# Altium project Design 1 - Receiver Module.PrjPcb
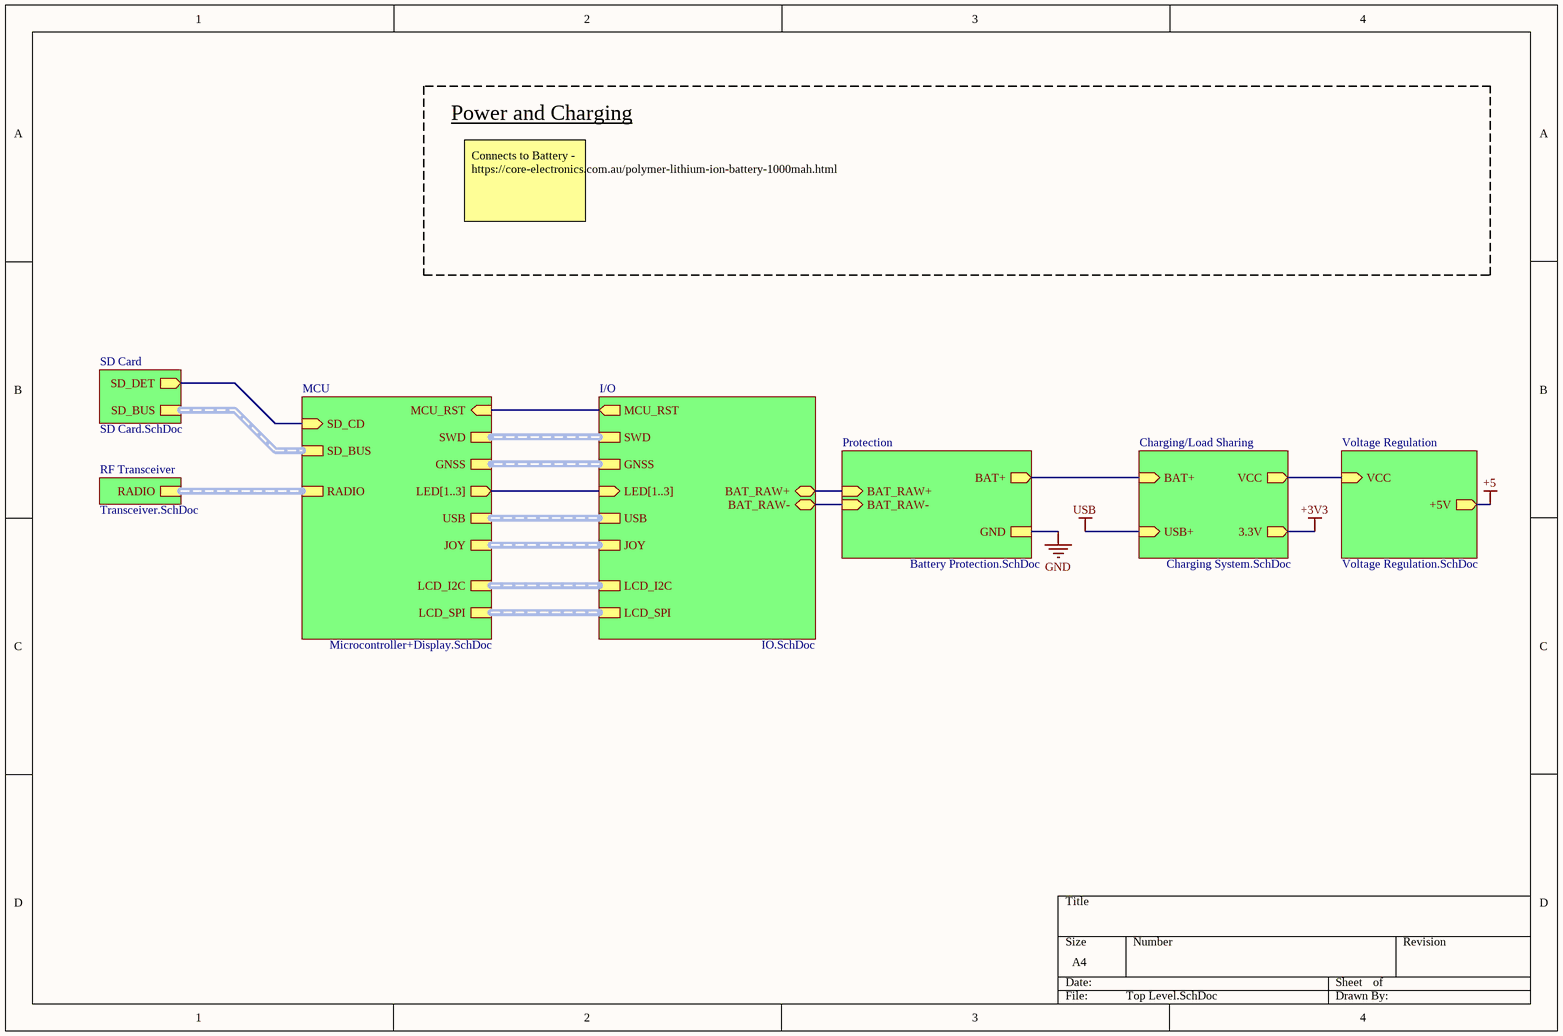
[diagram p0: Top Level.SchDoc]
7 sheets, 60 parts. Net scope: hierarchical (ports join the sheet entries above them; power ports are global).
Board file: Receiver Module.PcbDoc
Sheets:
  Top Level.SchDoc
    Voltage Regulation = Voltage Regulation.SchDoc
    I/O = IO.SchDoc
    RF Transceiver = Transceiver.SchDoc
    Protection = Battery Protection.SchDoc
    Charging/Load Sharing = Charging System.SchDoc
    SD Card = SD Card.SchDoc

## Sheet Top Level.SchDoc
size A4; SheetNumber: 1; SheetTotal: 8

### Sub-sheets
Charging/Load Sharing = Charging System.SchDoc: USB+ (in), BAT+ (in), VCC (out), 3.3V (out)
I/O = IO.SchDoc: USB (harness USB), SWD (harness SWD), JOY (harness JOY), LED[1..3] (in), MCU_RST (out), LCD_SPI (harness LCD_SPI), LCD_I2C (harness LCD_I2C), GNSS (harness GNSS), BAT_RAW+ (bidir), BAT_RAW- (bidir)
MCU = Microcontroller+Display.SchDoc (file not in this document): SD_BUS (harness SD_BUS), MCU_RST (in), SWD (harness SWD), RADIO (harness RADIO), USB (harness USB), JOY (harness JOY), SD_CD (in), LCD_I2C (harness LCD_I2C), LCD_SPI (harness LCD_SPI), LED[1..3] (out), GNSS (harness GNSS)
Protection = Battery Protection.SchDoc: BAT_RAW+ (in), BAT_RAW- (in), BAT+ (out), GND
RF Transceiver = Transceiver.SchDoc: RADIO (harness RADIO)
SD Card = SD Card.SchDoc: SD_BUS (harness SD_BUS), SD_DET (out)
Voltage Regulation = Voltage Regulation.SchDoc: VCC (in), +5V (out)

### Nets
BAT+: sheet I/O/BAT_RAW+, sheet Protection/BAT_RAW+, sheet Protection/BAT+, sheet Charging/Load Sharing/BAT+
BAT_RAW-: sheet I/O/BAT_RAW-, sheet Protection/BAT_RAW-
MCU_RST: sheet I/O/MCU_RST, sheet MCU/MCU_RST
NetC6_1: sheet Voltage Regulation/VCC, sheet Charging/Load Sharing/VCC
NetR1_2: sheet MCU/SD_CD, sheet SD Card/SD_DET

### Buses and harness runs
bus sheet I/O/LED[1..3] = sheet MCU/LED[1..3]
harness sheet I/O/GNSS = sheet MCU/GNSS
harness sheet I/O/JOY = sheet MCU/JOY
harness sheet I/O/LCD_I2C = sheet MCU/LCD_I2C
harness sheet I/O/LCD_SPI = sheet MCU/LCD_SPI
harness sheet I/O/SWD = sheet MCU/SWD
harness sheet I/O/USB = sheet MCU/USB
harness sheet MCU/RADIO = sheet RF Transceiver/RADIO
harness sheet MCU/SD_BUS = sheet SD Card/SD_BUS

### Notes on the sheet
- Power and Charging
- Connects to Battery - https://core-electronics.com.au/polymer-lithium-ion-battery-1000mah.html

## Sheet Voltage Regulation.SchDoc
size A4; SheetNumber: 4; SheetTotal: 8
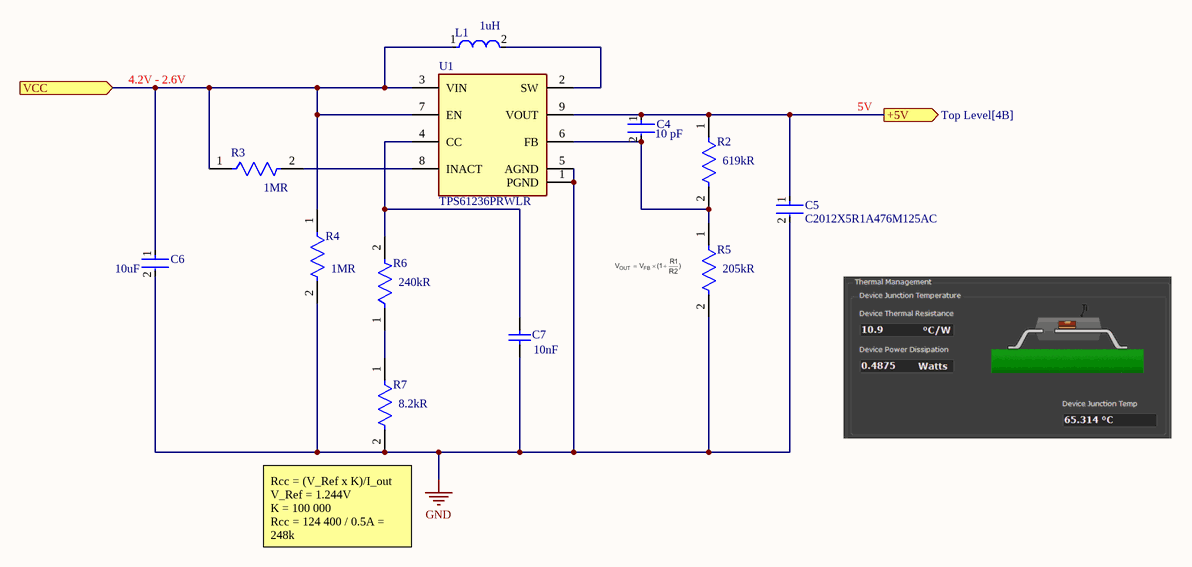
[diagram p1: Voltage Regulation.SchDoc]

### Parts
C4  value 10 pF  [FP-C0805C-DN-MFG]  (hidden comment: C0805C100M4GACTU)
C5  C2012X5R1A476M125AC  [FP-C2012-125-0_2-IPC_B]
C6  Capacitance: 10uF  [FP-GRM21B-0_15-IPC_A]  (hidden comment: GRM21BR61E106MA73L)
C7  Capacitance: 10nF  [CAPC1005X55X25NL05T10]  (hidden comment: GRM155R61A103KA01D)
L1  Inductance: 1uH  [FP-DFE201612C-MFG]  (hidden comment: 1286AS-H-1R0M=P2)
R2  Resistance: 619kR  [FP-CRCW0402-e3-IPC_C]  (hidden comment: CRCW0402619KFKED)
R3  Resistance: 1MR  [FP-CRCW0402-C-e3-MFG]  (hidden comment: CRCW04021M00FKEDC)
R4  Resistance: 1MR  [FP-CRCW0402-C-e3-MFG]  (hidden comment: CRCW04021M00FKEDC)
R5  Resistance: 205kR  [FP-AC0402-MFG]  (hidden comment: AC0402FR-07205KL)
R6  Resistance: 240kR  [FP-ESR03-MFG]  (hidden comment: ESR03EZPJ244)
R7  Resistance: 8.2kR  [FP-CRCW2010-e3-IPC_C]  (hidden comment: CRCW20108K20JNEF)
U1  TPS61236PRWLR  [TPS61235PRWLT]

### Ports
+5V (out, see Top Level[4B]), VCC (in, see Top Level[4B], Charging System[3B])

### Nets
+5: C4.1 C5.1 R2.1 U1.9(VOUT) ; port +5V
GND: C5.2 C6.2 C7.2 R4.2 R5.2 R7.2 U1.1(PGND) U1.5(AGND)
NetC4_2: C4.2 R2.2 R5.1 U1.6(FB)
NetC6_1: C6.1 L1.1 R3.1 R4.1 U1.3(VIN) U1.7(EN) ; port VCC
NetC7_1: C7.1 R6.2 U1.4(CC)
NetL1_2: L1.2 U1.2(SW)
NetR3_2: R3.2 U1.8(INACT)
NetR6_1: R6.1 R7.1

### Notes on the sheet
- 4.2V - 2.6V
- 5V
- (near R7) Rcc = (V_Ref x K)/I_out
  V_Ref = 1.244V
  K = 100 000
  Rcc = 124 400 / 0.5A = 248k

### Library data of the parts
C4 = CMP-1036-00838-4: CAP CER 10PF 16V 20% NP0 0805; Manufacturer: KEMET; Material: Ceramic; Tolerance: 0.2; Temperature Characteristic: C0G; Temperature Coefficient: 30ppm/°C; Height: 0.88mm; Mouser Description: Multilayer Ceramic Capacitors MLCC - SMD/SMT 16volts 10pF C0G 20%; Device Class L2: Capacitors; Temperature Range Low: -55°C; Manufacturer Part Number: C0805C100M4GACTU; ComponentLink2URL: https://content.kemet.com/datasheets/KEM_C1003_C0G_SMD.pdf; Category: Cap; Octopart: https://octopart.com/c0805c100m4gactu-kemet-16430157; Device Class L1: Passive Components; Capacitance: 10 pF; Temperature: -55°C to +125°C; RoHS: TRUE; Package: C0805C-DN; Device Class L3: Ceramic Capacitors; Automotive: No; Voltage Rating: 16 V; Digikey Description: CAP CER 10PF 16V 20% NP0 0805; Temperature Range High: +125°C; Ipc Land Pattern Name: CAPC200125X78; Lead Free: Yes; ComponentLink2Description: Datasheet
C5 = CMP-2000-05451-2: Multilayer Ceramic Capacitors 47μF ±20% 10V X5R SMD 0805; Capacitance: 47uF; RoHS Compliant: Yes; Dielectric: X5R; Case Code (Imperial): 0805; Min Operating Temperature: -55°C; Length: 2mm; Voltage Rating: 10V; Lead Free: Lead Free; Weight: 0.000194oz; Resistor Type: Ceramic; Dielectric Material: Ceramic; Max Operating Temperature: 85°C; Height: 1.25mm; Width: 0.049inch; Depth: 1.25mm; Termination: SMD/SMT; Case/Package: 0805; Voltage Rating (DC): 10V; Voltage: 10V; Thickness: 0.057inch; Tolerance: 20%; REACH SVHC: No SVHC; Package Quantity: 1; Series: C; Case Code (Metric): 2012; Mount: Surface Mount; Packaging: Tape and Reel
C6 = CMP-06035-013048-1: Chip Multilayer Ceramic Capacitors for General Purpose, 0805, 10uF, X5R, 15%, 20%, 25V; Max Operating Temperature: 85°C; Package Quantity: 3000; Case/Package: 0805; Depth: 1.25mm; Case Code (Imperial): 0805; Termination: SMD/SMT; Width: 0.049inch; Packaging: Tape and Reel; Tolerance: 20%; Height: 1.25mm; Min Operating Temperature: -55°C; Weight: 0.000335oz; Voltage Rating (DC): 25V; Dielectric: X5R; Length: 2mm; Thickness: 0.055inch; Voltage Rating: 25V; Resistor Type: Ceramic; Lead Free: Lead Free; Case Code (Metric): 2012; Mount: Surface Mount; REACH SVHC: No SVHC
C7 = CMP-2008-03935-1: Manufacturer: Murata; Part Number: GRM155R61A103KA01D
L1 = CMP-06042-000171-1: FIXED IND 1UH 2.5A 82 MOHM SMD; Tolerance: 20%; Core Material: Ferrite; Max DC Current: 2.3A; Shielding: Shielded; DC Resistance (DCR): 82mR; Test Frequency: 1MHz; Packaging: Tape and Reel; Case Code (Metric): 2016; Depth: 1.6mm; Min Operating Temperature: -40°C; Current Rating: 2.5A; Case/Package: 0806; Case Code (Imperial): 0806; Height - Seated (Max): 0.047inch; Length: 0.079inch; Max Operating Temperature: 85°C; Mount: Surface Mount; Resistor Type: Wirewound; Width: 0.063inch
R2 = CMP-1011-00826-5: RES Thick Film, 619kΩ, 1%, 0.063W, 100ppm/°C, 0402; Voltage Rating: 50V; Power Rating: 63mW; Width: 0.02inch; Case Code (Metric): 1005; Tolerance: 1%; Case Code (Imperial): 0402; Lead Free: Lead Free; Case/Package: 0402; Radiation Hardening: No; Termination: Solder; Voltage Rating (DC): 50V; Number of Terminations: 2; Depth: 0.5mm; Length: 1mm; Contact Plating: Tin; Temperature Coefficient: 100ppm/°C; Max Power Dissipation: 63mW; Weight: 2.3E-05oz; Height: 0.35mm; Military Standard: Not; Package Quantity: 10; Composition: Thick Film; Max Operating Temperature: 155°C; Packaging: Tape and Reel; Min Operating Temperature: -55°C; Features: Automotive AEC-Q200
R3 R4 = CMP-02407-013080-1: RES 1M OHM 1% 1/16W 0402; Max Power Dissipation: 63mW; Temperature Coefficient: 100ppm/°C; Power Rating: 62.5mW; Tolerance: 1%; Contact Plating: Tin; Max Operating Temperature: 155°C; Number of Terminations: 2; Min Operating Temperature: -55°C; Lead Free: Lead Free; Length: 1mm; RoHS Compliant: Yes; Series: CRCW-C; Case/Package: 0402; Packaging: Tape and Reel; Mount: Surface Mount; Resistor Type: Thick Film; Termination: Wraparound
R5 = CMP-03412-004258-2: RES 205kΩ ±1% 0.063W 0402; Power Rating: 62.5mW; Max Power Dissipation: 63mW; Temperature Coefficient: 100ppm/°C; Voltage Rating: 50V; Series: AC; Weight: 2.3E-05oz; Max Operating Temperature: 155°C; Case Code (Imperial): 0402; Resistor Type: Thick Film; Length: 0.039inch; Min Operating Temperature: -55°C; Ratings: AEC-Q200; Case Code (Metric): 1005; Tolerance: 1%; Packaging: Tape and Reel; Termination: SMD/SMT; Features: Moisture Resistant; Case/Package: 0402; RoHS Compliant: Yes; Number of Terminations: 2; Width: 0.5mm; Height: 0.015inch
R6 = CMP-08839-028178-1: 240kΩ ±5% 0.25W 0603 Anti-Surge Chip Resistor AEC-Q200; Temperature Coefficient: 200ppm/°C; Max Power Dissipation: 250mW; Min Operating Temperature: -55°C; Packaging: Tape and Reel; Max Operating Temperature: 155°C; Case/Package: 0603; Series: ESR; Tolerance: 5%; Features: Automotive AEC-Q200; RoHS Compliant: Yes; Case Code (Metric): 1608; Number of Terminations: 2; Package Quantity: 5000; Width: 0.031inch; Case Code (Imperial): 0603; Resistor Type: Thick Film; Height: 0.022inch; Length: 0.063inch
R7 = CMP-02407-002670-1: RES Thick Film, 8.2kΩ, 5%, 0.75W, 200ppm/°C, 2010; Voltage Rating: 400V; Power Rating: 750mW; Composition: Thick Film; Package Quantity: 4000; Contact Plating: Tin; Depth: 2.5mm; Case Code (Imperial): 2010; Tolerance: 5%; Weight: 0.000899oz; Length: 5mm; Height: 0.6mm; Temperature Coefficient: 200ppm/°C; Termination: SMD/SMT; Voltage Rating (DC): 400V; Lead Free: Lead Free; Case Code (Metric): 5025; Case/Package: 2010; Military Standard: Not; Radiation Hardening: No; Packaging: Tape and Reel; Max Operating Temperature: 155°C; Min Operating Temperature: -55°C; Width: 2.5mm
U1 = TPS61236PRWLR: Integrated Circuit; Manufacturer_Name: Texas Instruments; Datasheet Link: http://www.ti.com/lit/ds/symlink/tps61236p.pdf; Manufacturer_Part_Number: TPS61236PRWLR; Mouser Part Number: 595-TPS61236PRWLR; Mouser Price/Stock: https://www.mouser.co.uk/ProductDetail/Texas-Instruments/TPS61236PRWLR?qs=LuYMPh7GGMSj5RXH1N1%2Fpw%3D%3D; Arrow Part Number: TPS61236PRWLR; Arrow Price/Stock: https://www.arrow.com/en/products/tps61236prwlr/texas-instruments?region=nac

## Sheet IO.SchDoc
size A4; SheetNumber: 7; SheetTotal: 8
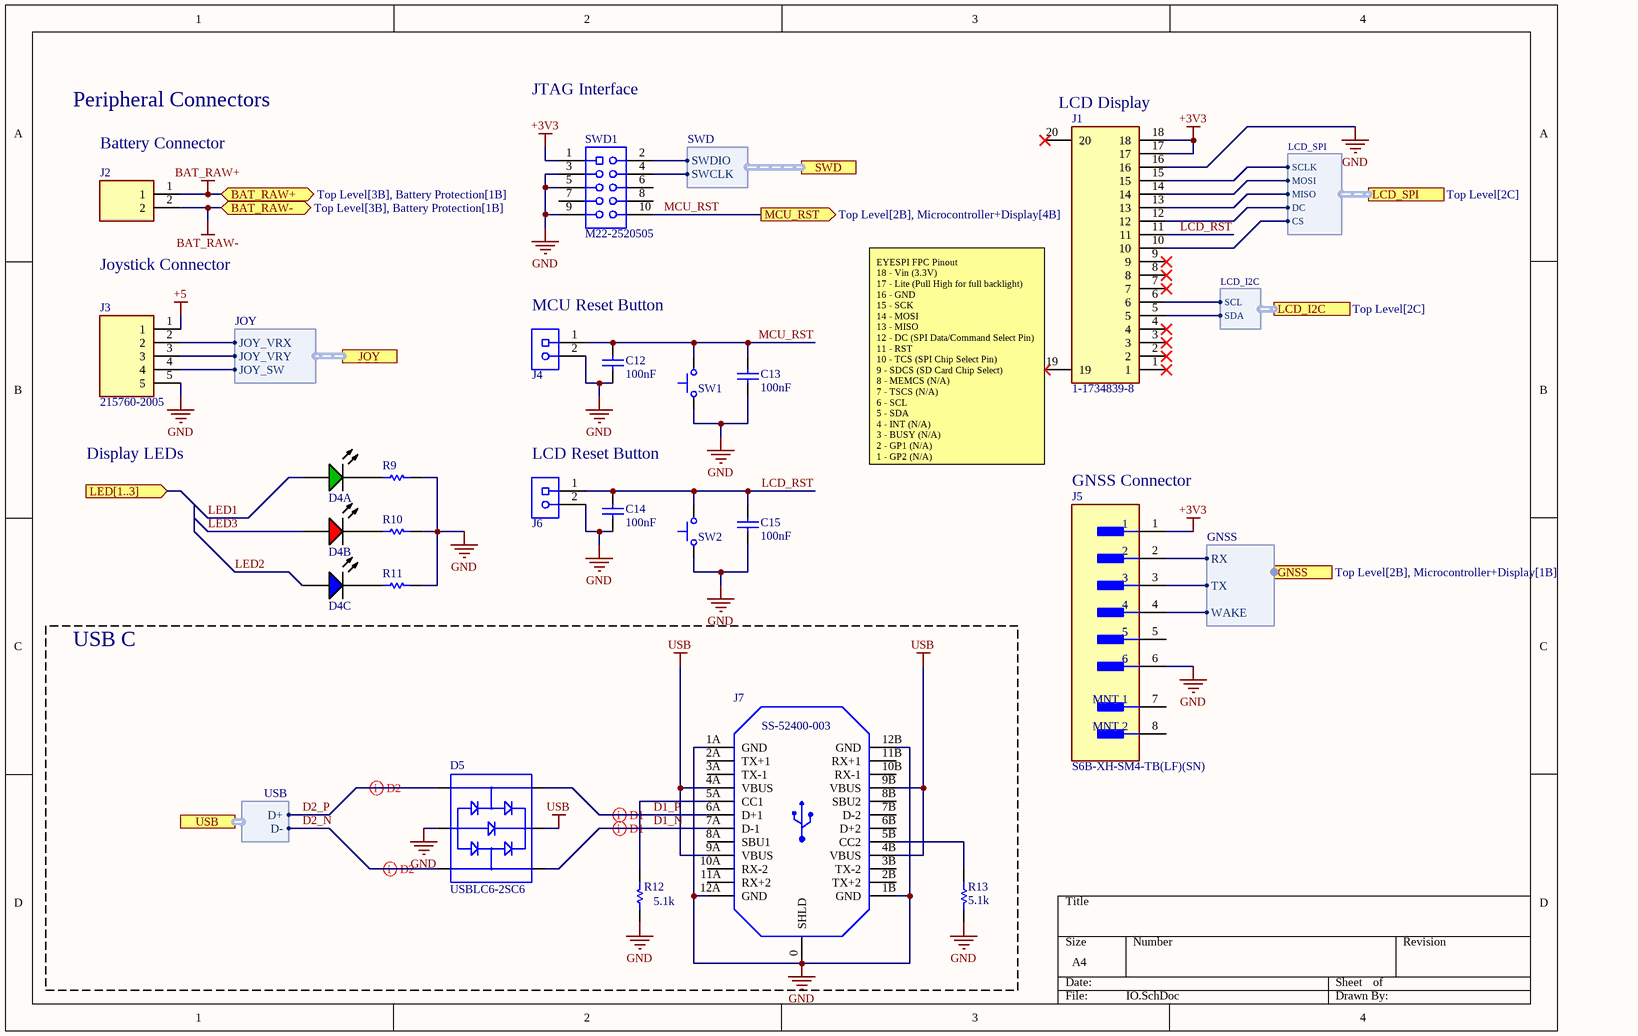
[diagram p2: IO.SchDoc]

### Parts
C12  value 100nF  [CAPC1608X10N]  (hidden comment: C0603C104M5RACTU)
C13  value 100nF  [CAPC1608X10N]  (hidden comment: C0603C104M5RACTU)
C14  value 100nF  [CAPC1608X10N]  (hidden comment: C0603C104M5RACTU)
C15  value 100nF  [CAPC1608X10N]  (hidden comment: C0603C104M5RACTU)
D4  LRTBGVSR-U4V2-JW+A6BB-D8+S2U2-7Z-20-S  [LRTBGVSG-UEVE-24+AMAQ-29+SCUC-HR-Footprint-1]  (value not drawn)  (parts A,B,C of 3)
D5  USBLC6-2SC6  [USBLC6-2SC6]
J1  1-1734839-8  [117348398]
J2  S2B-PH-K-S__LF__SN_  [SHDRRA2W50P0X200_1X2_590X760X480P]  (value not drawn)
J3  215760-2005  [215760-YY05]
J4  22-28-4020  [22-28-4020]  (value not drawn)
J5  S6B-XH-SM4-TB(LF)(SN)  [FP-S6B-XH-SM4-TB_LF_SN-MFG]
J6  22-28-4020  [22-28-4020]  (value not drawn)
J7  SS-52400-003  [SS52400005]
R9  CRCW06031K00FKEA  [0603]  (value not drawn)
R10  CRCW06031K00FKEA  [0603]  (value not drawn)
R11  CRCW06031K00FKEA  [0603]  (value not drawn)
R12  value 5.1k  [0603]  (hidden comment: CRCW06035K10FKEA)
R13  value 5.1k  [0603]  (hidden comment: CRCW06035K10FKEA)
SW1  B3U-1000P  [B3U-1000P]  (value not drawn)
SW2  B3U-1000P  [B3U-1000P]  (value not drawn)
SWD1  M22-2520505  [M22-2520505]

### Blocks framed on the sheet
USB C: D5 J7 R12 R13

### Ports
BAT_RAW+ (bidir, see Top Level[3B], Battery Protection[1B]), BAT_RAW- (bidir, see Top Level[3B], Battery Protection[1B]), GNSS (harness GNSS, see Top Level[2B], Microcontroller+Display[1B]), JOY (harness JOY, see Top Level[2C], Microcontroller+Display[2D]), LCD_I2C (harness LCD_I2C, see Top Level[2C]), LCD_SPI (harness LCD_SPI, see Top Level[2C]), LED[1..3] (in, see Top Level[2B], Microcontroller+Display[3A]), MCU_RST (out, see Top Level[2B], Microcontroller+Display[4B]), SWD (harness SWD, see Top Level[2B], Microcontroller+Display[1C]), USB (harness USB, see Top Level[2C], Microcontroller+Display[1B])

### Harnesses
USB: D+, D-
JOY: JOY_VRX, JOY_VRY, JOY_SW
LCD_SPI: SCLK, MOSI, MISO, DC, CS
LCD_I2C: SCL, SDA
SWD: SWDIO, SWCLK
GNSS: TX, RX, WAKE

### Nets
+3V3: J1.17 J1.18 J5.1 SWD1.1(VDD)
+5: J3.1
BAT_RAW+: J2.1 ; port BAT_RAW+  [project net BAT+]
BAT_RAW-: J2.2 ; port BAT_RAW-
GND: C12.1 C13.1 C14.1 C15.1 D5.2 J1.16 J3.5 J4.2 J5.6 J6.2 J7.0(SHLD) J7.1A(GND) J7.1B(GND) J7.12A(GND) J7.12B(GND) R9.2 R10.2 R11.2 R12.1 R13.1 SW1.1 SW2.1 SWD1.3(GND) SWD1.5(GND) SWD1.9(GND)
USB: D5.5 J7.4A(VBUS) J7.4B(VBUS) J7.9A(VBUS) J7.9B(VBUS)
D1_N: D5.6 J7.7A(D-1)
D1_P: D5.4 J7.6A(D+1)
D2_N: D5.1 ; port USB.D-
D2_P: D5.3 ; port USB.D+
LCD_RST: C14.2 C15.2 J1.11 J6.1 SW2.2
LED1: D4.6(A1)
LED2: D4.2(A3)
LED3: D4.5(A2)
MCU_RST: C12.2 C13.2 J4.1 SW1.2 SWD1.10(NRST) ; port MCU_RST
NetD4_1: D4.1(K1) R9.1
NetD4_3: D4.3(K3) R11.1
NetD4_4: D4.4(K2) R10.1
NetJ1_5: J1.5 ; port LCD_I2C.SDA
NetJ1_6: J1.6 ; port LCD_I2C.SCL
NetJ1_10: J1.10 ; port LCD_SPI.CS
NetJ1_12: J1.12 ; port LCD_SPI.DC
NetJ1_13: J1.13 ; port LCD_SPI.MISO
NetJ1_14: J1.14 ; port LCD_SPI.MOSI
NetJ1_15: J1.15 ; port LCD_SPI.SCLK
NetJ3_2: J3.2 ; port JOY.JOY_VRX
NetJ3_3: J3.3 ; port JOY.JOY_VRY
NetJ3_4: J3.4 ; port JOY.JOY_SW
NetJ5_2: J5.2 ; port GNSS.RX
NetJ5_3: J5.3 ; port GNSS.TX
NetJ5_4: J5.4 ; port GNSS.WAKE
NetJ7_5A: J7.5A(CC1) R12.2
NetJ7_5B: J7.5B(CC2) R13.2
NetSWD1_2: SWD1.2(SWDIO) ; port SWD.SWDIO
NetSWD1_4: SWD1.4(SWCLK) ; port SWD.SWCLK

Not connected (* = marked no-connect by the designer): J1 1* 2* 3* 4* 7* 8* 9* 19* 20*; J5 5 7(MNT_1) 8(MNT_2); J7 2A(TX+1) 2B(TX+2) 3A(TX-1) 3B(TX-2) 6B(D+2) 7B(D-2) 8A(SBU1) 8B(SBU2) 10A(RX-2) 10B(RX-1) 11A(RX+2) 11B(RX+1); SWD1 6(SWO) 7(NC) 8(NC)

### Layout directives
differential pair: D1_N, D1_P, D2_N, D2_P

### Notes on the sheet
- Peripheral Connectors
- JTAG Interface
- (near J1) LCD Display
- (near J2) Battery Connector
- Joystick Connector
- MCU Reset Button
- Display LEDs
- LCD Reset Button
- (near J1) EYESPI FPC Pinout
  18 - Vin (3.3V)
  17 - Lite (Pull High for full backlight)
  16 - GND
  15 - SCK
  14 - MOSI
  13 - MISO
  12 - DC (SPI Data/Command Select Pin)
  11 - RST
  10 - TCS (SPI Chip Select Pin)
  9 - SDCS (SD Card Chip Select)
  8 - MEMCS (N/A)
  7 - TSCS (N/A)
  6 - SCL
  5 - SDA
  4 - INT (N/A)
  3 - BUSY (N/A)
  2 - GP1 (N/A)
  1 - GP2 (N/A)
- (near J5) GNSS Connector

### Library data of the parts
C12-C15 = C0603C104M5RACTU: Cap Ceramic 0.1uF 50V X7R 20% SMD 0603 125C T/R; Dissipation Factor: 2.5%; Min Operating Temperature: -55°C; Contact Plating: Tin,Matte; Height: 0.8mm; Voltage Rating: 50V; REACH SVHC: No SVHC; Max Operating Temperature: 125°C; Termination: SMD/SMT; Package Quantity: 1; Capacitance: 100nF; Packaging: Tape and Reel; Width: 0.031inch; Depth: 0.8mm; Dielectric: X7R; Tolerance: 20%; Lead Pitch: 0.7mm; Thickness: 0.034inch; Length: 1.6mm; Dielectric Material: Ceramic; Radiation Hardening: No; Voltage Rating (DC): 50V; Case/Package: 0603; Case Code (Metric): 1608; Mount: Surface Mount,PCB; Case Code (Imperial): 0603; JLC_PN: C14663
D4 = LRTBGVSR-U4V2-JW+A6BB-D8+S2U2-7Z-20-S: LED Multicolor Red/True Green/Blue 626nm/528nm/465nm 40mA/50mA/50mA 6-Pin SMD T/R
D5 = USBLC6-2SC6: ESD Suppressors / TVS Diodes ESD Protection Low Cap
J1 = 1-1734839-8: Connector; Manufacturer_Name: TE Connectivity; Description: AMP - TE CONNECTIVITY - 1-1734839-8 - CONNECTOR; Datasheet Link: https://www.te.com/commerce/DocumentDelivery/DDEController?Action=showdoc&DocId=Customer+Drawing%7F1734839%7FC%7Fpdf%7FEnglish%7FENG_CD_1734839_C_C_1734839.pdf%7F1-1734839-8; Height: 2.05mm; Manufacturer_Part_Number: 1-1734839-8; Mouser Part Number: 571-1-1734839-8; Mouser Price/Stock: https://www.mouser.co.uk/ProductDetail/TE-Connectivity/1-1734839-8?qs=sXy4Dx%2FMQpOw5EO3e3m3KA%3D%3D; Arrow Part Number: 1-1734839-8; Arrow Price/Stock: https://www.arrow.com/en/products/1-1734839-8/te-connectivity
J2 = S2B-PH-K-S__LF__SN_: Connector; Manufacturer_Name: JST (JAPAN SOLDERLESS TERMINALS); Manufacturer_Part_Number: S2B-PH-K-S (LF)(SN); Datasheet Link: http://www.jst-mfg.com/product/pdf/eng/ePH.pdf; Height: 4.8mm
J3 = 215760-2005: Connector; Manufacturer_Name: Molex; Datasheet Link: https://www.molex.com/pdm_docs/sd/2157601002_sd.pdf; Height: 5.87mm; Manufacturer_Part_Number: 215760-2005; Mouser Part Number: 538-215760-2005; Mouser Price/Stock: https://www.mouser.co.uk/ProductDetail/Molex/215760-2005?qs=pBJMDPsKWf1lOu66Lw3MIg%3D%3D
J4 J6 = 22-28-4020: KK 254 Breakaway Header, Vertical, 2 Circuits, Tin (Sn) Plating, Mating Pin Length 6.09mm 2 POS; Number of Positions: 2; Voltage Rating (DC): 250V; Contact Resistance: 20mR; Gender: Male; Connector Type: Male Pin; Glow Wire Compliant: Non-compliant; Pitch: 2.54mm; Current Rating: 4A; Orientation: Straight; Flammability Rating: UL94 V-0; Termination: Solder; Mount: Through Hole; Housing Color: Black; Contact Mating Length: 0.24inch; Min Operating Temperature: 0°C; Package Quantity: 1; Color: Black; Voltage Rating: 250V; REACH SVHC: Unknown; Contact Plating: Tin; Packaging: Bulk; Max Voltage Rating (DC): 250V; Max Operating Temperature: 75°C; Number of Circuits: 2; Housing Material: Nylon; Number of Contacts: 2; Lead Free: Lead Free; Radiation Hardening: No; Number of Rows: 1; Contact Material: Brass,Bronze; Mounting Technology: Through Hole; Depth: 2.49mm; Max Voltage Rating (AC): 250V; Series: KK® 42375; Contact Type: Male Pin
J5 = S6B-XH-SM4-TB(LF)(SN): CONN HEADER SMD R/A 6POS 2.5MM; Gender: Male; Number of Positions: 6; Max Current Rating: 3A; Voltage Rating: 250V; Contact Resistance: 20mR; Flammability Rating: UL94 V-0; Orientation: Right Angle; Contact Finish - Mating: TIN; Packaging: Tape and Reel; Termination: Solder; Pitch: 2.5mm; Housing Color: Beige; Insulation Material: Nylon; Fastening Type: Detent; Housing Material: Polyamide; Package Quantity: 1; Mount: Surface Mount; Insulation Color: Natural; Series: XH; Depth: 7mm; Contact Shape: Square; Color: Natural; Max Voltage Rating (AC): 250V; Min Operating Temperature: -25°C; Number of Contacts: 6; Lead Free: Lead Free; Contact Material: Copper Alloy; Contact Type: Male Pin; Length: 20mm; Max Operating Temperature: 85°C; Connector Type: Header; Number of Rows: 1; REACH SVHC: No SVHC; Contact Plating: Copper
J7 = SS-52400-003: USB Type-C Receptacle for 1.60mm PCB; Manufacturer_Name: BelFuse; Manufacturer_Part_Number: SS-52400-005; Datasheet Link: https://www.belfuse.com/resources/drawings/stewartconnector/dr-STW-SS-52400-005.pdf; Mouser Part Number: 530-SS-52400-005; Mouser Price/Stock: https://www.mouser.co.uk/ProductDetail/Stewart-Connector-Bel/SS-52400-005?qs=Wj%2FVkw3K%252BMC%2FVoWwkQ%252BKYA%3D%3D
R9-R11 = CRCW06031K00FKEA: VISHAY - CRCW06031K00FKEA - SMD Chip Resistor, 0603 [1608 Metric], 1 kohm, CRCW e3 Series, 75 V, Thick Film, 100 mW; Value: 5.1k
R12 R13 = CRCW06035K10FKEA: Res Thick Film 0603 5.1K Ohm 1% 1/10W ±100ppm/°C Molded SMD SMD Paper T/R
SW1 SW2 = B3U-1000P: SWITCH TACTILE SPST-NO 0.05A 12V; Actuator Length: 0.4mm; Contact Resistance: 100mR; Mechanical Life: 200000Cycles; Contact Current Rating: 50mA; Illumination Type: Non-Illuminated,Illuminated; Actuator Type: Standard; Ratings: Dust Proof,IP40; Switch Travel: 0.15mm; Throw Configuration: SPST; Operating Force: 1.5N; Switch Function: Off-Mom; Width: 3mm; REACH SVHC: Unknown; Max Voltage Rating (DC): 12V; Packaging: Tape and Reel; Mount: Surface Mount; Max Operating Temperature: 70°C; Min Operating Temperature: -25°C; Length: 4mm; Depth: 2.5mm; Termination: SMD/SMT; Contact Material: Silver; Weight: 0.000776oz; Current Rating: 50mA; Package Quantity: 1; Max Current Rating: 50mA; Lead Free: Lead Free; Voltage Rating (DC): 12V; Electrical Life: 200000Cycles; Insulation Resistance: 100MR; Orientation: Straight; Height: 1.2mm

## Sheet Transceiver.SchDoc
size A4; SheetNumber: 2; SheetTotal: 8
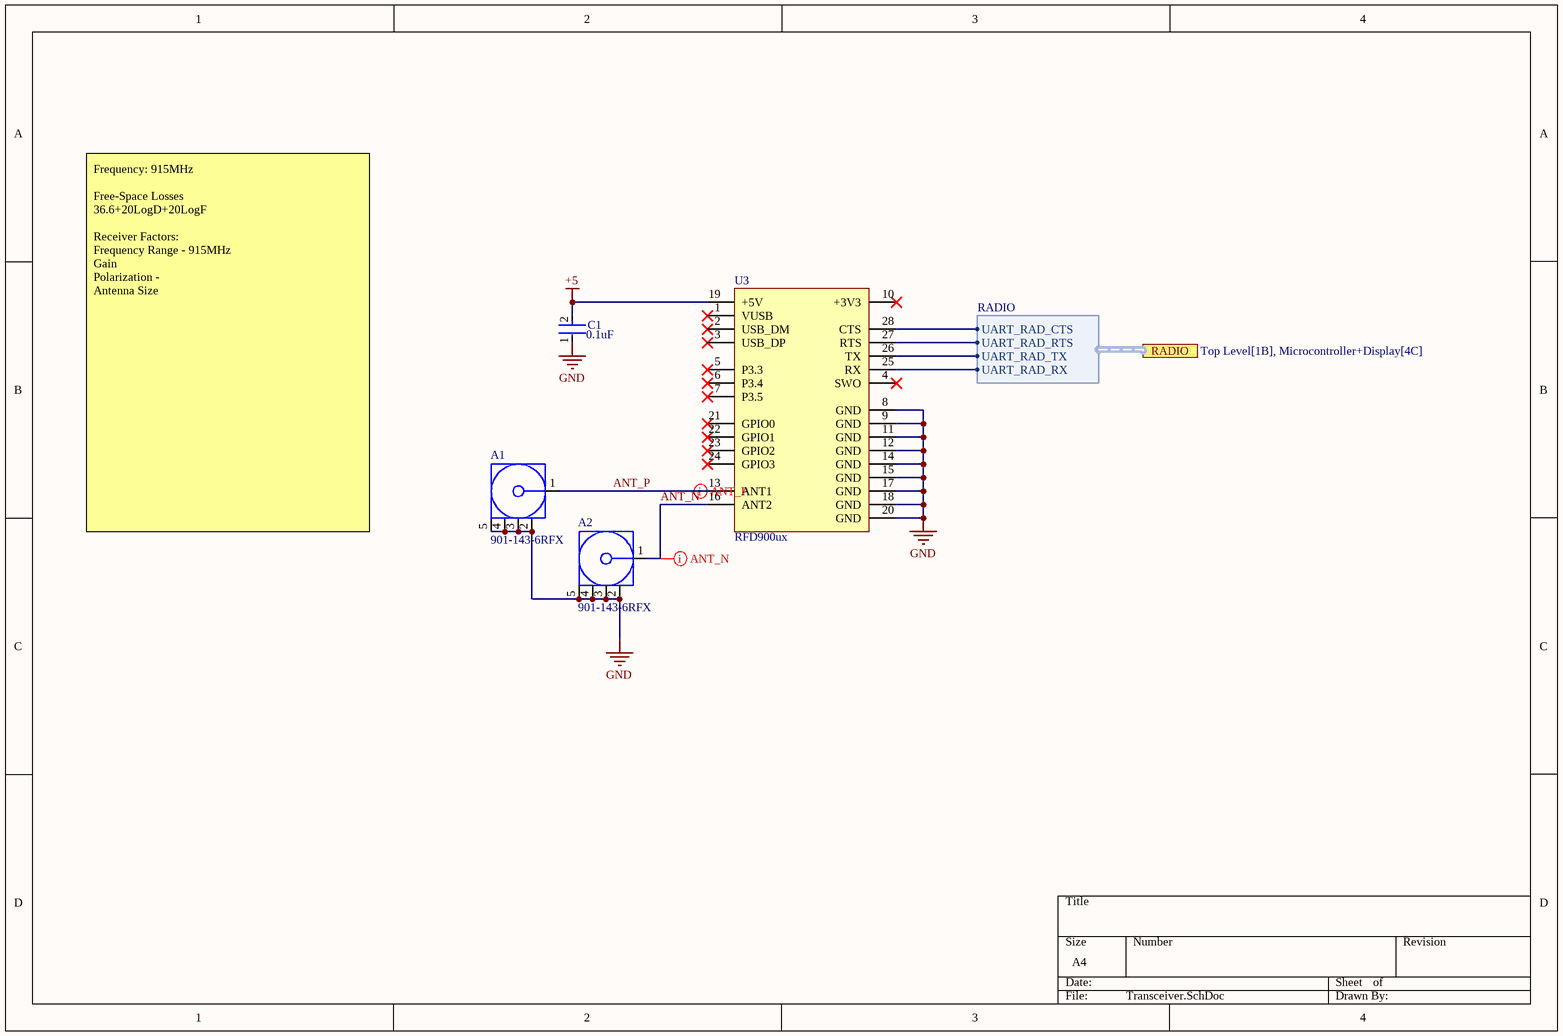
[diagram p3: Transceiver.SchDoc]

### Parts
A1  901-143-6RFX  [903-143-6RFX]
A2  901-143-6RFX  [903-143-6RFX]
C1  Capacitance: 0.1uF  [FP-C1608-080-0_1-MFG]  (hidden comment: C1608X5R1A106K080AC)
U3  RFD900ux  [RFD900UX]

### Ports
RADIO (harness RADIO, see Top Level[1B], Microcontroller+Display[4C])

### Harnesses
RADIO: UART_RAD_CTS, UART_RAD_RTS, UART_RAD_TX, UART_RAD_RX

### Nets
+5: C1.2 U3.19(+5V)
GND: A1.2 A1.3 A1.4 A1.5 A2.2 A2.3 A2.4 A2.5 C1.1 U3.8(GND) U3.9(GND) U3.11(GND) U3.12(GND) U3.14(GND) U3.15(GND) U3.17(GND) U3.18(GND) U3.20(GND)
ANT_N: A2.1 U3.16(ANT2)
ANT_P: A1.1 U3.13(ANT1)
NetU3_25: U3.25(RX) ; port RADIO.UART_RAD_RX
NetU3_26: U3.26(TX) ; port RADIO.UART_RAD_TX
NetU3_27: U3.27(RTS) ; port RADIO.UART_RAD_RTS
NetU3_28: U3.28(CTS) ; port RADIO.UART_RAD_CTS

Not connected (* = marked no-connect by the designer): U3 1(VUSB)* 2(USB_DM)* 3(USB_DP)* 4(SWO)* 5(P3.3)* 6(P3.4)* 7(P3.5)* 10(+3V3)* 21(GPIO0)* 22(GPIO1)* 23(GPIO2)* 24(GPIO3)*

### Layout directives
differential pair: ANT_N, ANT_P

### Notes on the sheet
- Frequency: 915MHz
  Free-Space Losses
  36.6+20LogD+20LogF
  Receiver Factors:
  Frequency Range - 915MHz
  Gain
  Polarization -
  Antenna Size

### Library data of the parts
C1 = CMP-2000-04979-3: Multilayer Ceramic Capacitors 10μF ±10% 10V X5R SMD 0603; Dielectric Material: Ceramic; Construction: Flat; Height: 0.8mm; Thickness: 0.035inch; Case Code (Metric): 1608; Radiation Hardening: No; Number of Pins: 2; Voltage Rating (DC): 10V; Depth: 0.8mm; Voltage: 10V; RoHS Compliant: Yes; Voltage Rating: 10V; Package Quantity: 1; Resistor Type: Ceramic; Termination: SMD/SMT; Lead Free: Lead Free; REACH SVHC: No SVHC; Tolerance: 10%; Mount: Surface Mount; Series: C; Packaging: Tape and Reel; Width: 0.8mm; Dielectric: X5R; Weight: 7.1E-05oz; Length: 1.6mm; Max Operating Temperature: 85°C; Case Code (Imperial): 0603; Case/Package: 0603; Min Operating Temperature: -55°C

## Sheet Battery Protection.SchDoc
size A4; SheetNumber: 8; SheetTotal: 8
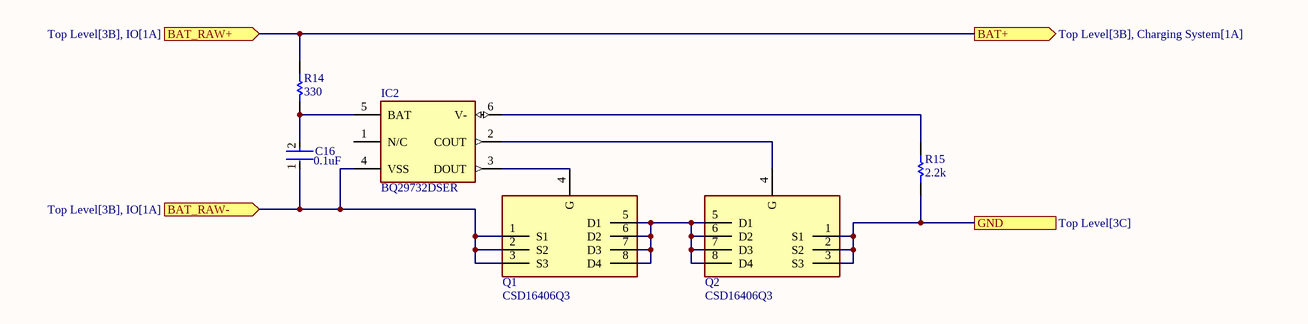
[diagram p4: Battery Protection.SchDoc]

### Parts
C16  Capacitance: 0.1uF  [FP-C1608-080-0_1-MFG]  (hidden comment: C1608X5R1A106K080AC)
IC2  BQ29732DSER  [SON50P150X150X80-6N]
Q1  CSD16406Q3  [DQG_VSON-CLIP]
Q2  CSD16406Q3  [DQG_VSON-CLIP]
R14  value 330  [0603]  (hidden comment: CRCW06032K10FKEAC)
R15  value 2.2k  [0603]  (hidden comment: CRCW06032K10FKEAC)

### Ports
BAT+ (out, see Top Level[3B], Charging System[1A]), BAT_RAW+ (in, see Top Level[3B], IO[1A]), BAT_RAW- (in, see Top Level[3B], IO[1A]), GND (see Top Level[3C])

### Nets
BAT+: R14.1 ; port BAT_RAW+, port BAT+
BAT_RAW-: C16.1 IC2.4(VSS) Q1.1(S1) Q1.2(S2) Q1.3(S3) ; port BAT_RAW-
GND: Q2.1(S1) Q2.2(S2) Q2.3(S3) R15.2 ; port GND
NetC16_2: C16.2 IC2.5(BAT) R14.2
NetIC2_2: IC2.2(COUT) Q2.4(G)
NetIC2_3: IC2.3(DOUT) Q1.4(G)
NetIC2_6: IC2.6(V-) R15.1
NetQ1_5: Q1.5(D1) Q1.6(D2) Q1.7(D3) Q1.8(D4) Q2.5(D1) Q2.6(D2) Q2.7(D3) Q2.8(D4)

Not connected (* = marked no-connect by the designer): IC2 1(N/C)

### Library data of the parts
C16 = CMP-2000-04979-3: as C1 on sheet Transceiver; Dielectric Material: Ceramic; Construction: Flat; Height: 0.8mm; Thickness: 0.035inch; Case Code (Metric): 1608; Radiation Hardening: No; Number of Pins: 2; Voltage Rating (DC): 10V; Depth: 0.8mm; Voltage: 10V; RoHS Compliant: Yes; Voltage Rating: 10V; Package Quantity: 1; Resistor Type: Ceramic; Termination: SMD/SMT; Lead Free: Lead Free; REACH SVHC: No SVHC; Tolerance: 10%; Mount: Surface Mount; Series: C; Packaging: Tape and Reel; Width: 0.8mm; Dielectric: X5R; Weight: 7.1E-05oz; Length: 1.6mm; Max Operating Temperature: 85°C; Case Code (Imperial): 0603; Case/Package: 0603; Min Operating Temperature: -55°C
IC2 = BQ29732DSER: Integrated Circuit; Manufacturer_Name: Texas Instruments; Datasheet Link: http://www.ti.com/lit/gpn/bq2973; Height: 0.8mm; Manufacturer_Part_Number: BQ29732DSER; Mouser Part Number: 595-BQ29732DSER; Mouser Price/Stock: https://www.mouser.co.uk/ProductDetail/Texas-Instruments/BQ29732DSER?qs=HjC056NR38EUdABiMgTGbg%3D%3D; Arrow Part Number: BQ29732DSER; Arrow Price/Stock: https://www.arrow.com/en/products/bq29732dser/texas-instruments?region=nac
Q1 Q2 = CSD16406Q3: MOSFET (N-Channel); Manufacturer_Name: Texas Instruments; Datasheet Link: http://www.ti.com/lit/gpn/csd16406q3; Manufacturer_Part_Number: CSD16406Q3; Mouser Part Number: 595-CSD16406Q3; Mouser Price/Stock: https://www.mouser.co.uk/ProductDetail/Texas-Instruments/CSD16406Q3?qs=SuDOdTVxq4Wogv4PDdDFZA%3D%3D; Arrow Part Number: CSD16406Q3; Arrow Price/Stock: https://www.arrow.com/en/products/csd16406q3/texas-instruments?region=nac
R14 R15 = CRCW06032K10FKEAC: Thick Film Resistors - SMD 1/10Watt 2.1Kohms 1%

## Sheet Charging System.SchDoc
size A4; SheetNumber: 6; SheetTotal: 8
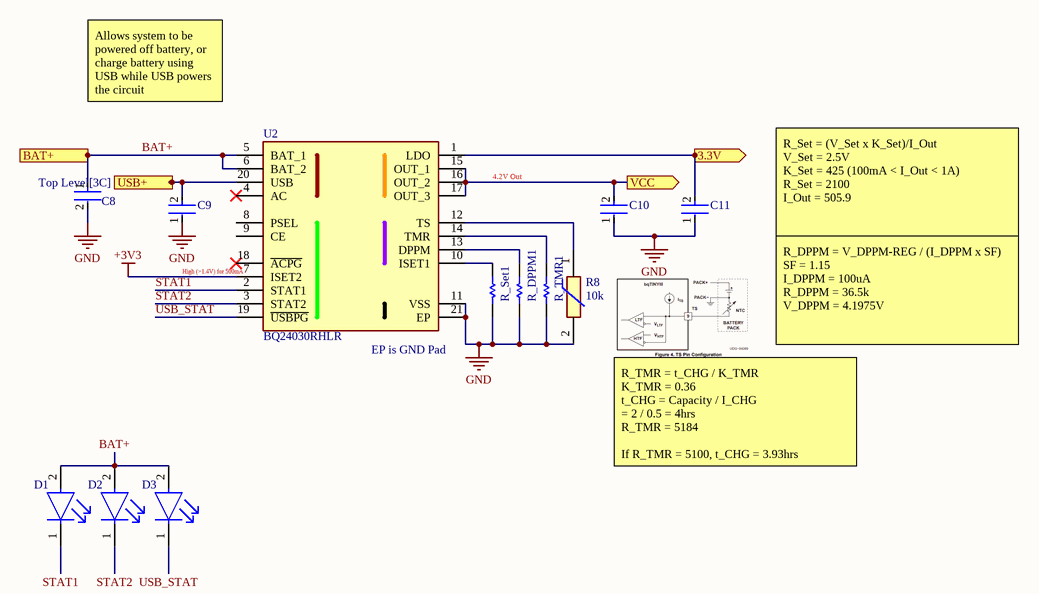
[diagram p5: Charging System.SchDoc]

### Parts
C8  06033D105KAT2A  [FP-0603-L_1_6_0_15-W_0_81-IPC_C]  (value not drawn)
C9  C1608X5R1A106K080AC  [FP-C1608-080-0_1-MFG]  (value not drawn)
C10  C1608X5R1A106K080AC  [FP-C1608-080-0_1-MFG]  (value not drawn)
C11  C1608X5R1A106K080AC  [FP-C1608-080-0_1-MFG]  (value not drawn)
D1  LTST-C190GKT  [FP-LTST-C190GKT-MFG]  (value not drawn)
D2  LTST-C190GKT  [FP-LTST-C190GKT-MFG]  (value not drawn)
D3  LTST-C190GKT  [FP-LTST-C190GKT-MFG]  (value not drawn)
R8  value 10k  [NTCALUG03A103GA]  (hidden comment: NTCALUG39A103GA)
R_DPPM1  RQ73C1J36K5BTD  [0603]  (value not drawn)
R_Set1  CRCW06032K10FKEAC  [0603]  (value not drawn)
R_TMR1  ERA-3AED512V  [0603]  (value not drawn)
U2  BQ24030RHLR  [BQ51050BRHLR]

### Ports
3.3V (out, see Top Level[4C]), BAT+ (in, see Top Level[3B], Battery Protection[3B]), USB+ (in, see Top Level[3C]), VCC (out, see Top Level[4B], Voltage Regulation[1B])

### Nets
+3V3: C11.2 U2.1(LDO) U2.7(ISET2) ; port 3.3V
BAT+: C8.1 D1.2(A) D2.2(A) D3.2(A) U2.5(BAT_1) U2.6(BAT_2) ; port BAT+
GND: C8.2 C9.1 C10.1 C11.1 R8.2 R_DPPM1.1 R_Set1.2 R_TMR1.1 U2.11(VSS) U2.21(EP)
USB: C9.2 U2.20(USB) ; port USB+
STAT1: D1.1(C) U2.2(STAT1)
STAT2: D2.1(C) U2.3(STAT2)
USB_STAT: D3.1(C) U2.19(~{USBPG})
NetC6_1: C10.2 U2.15(OUT_1) U2.16(OUT_2) U2.17(OUT_3) ; port VCC
NetR8_1: R8.1 U2.12(TS)
NetR_DPPM1_2: R_DPPM1.2 U2.13(DPPM)
NetR_Set1_1: R_Set1.1 U2.10(ISET1)
NetR_TMR1_2: R_TMR1.2 U2.14(TMR)

Not connected (* = marked no-connect by the designer): U2 4(AC)* 8(PSEL) 9(CE) 18(~{ACPG})*

### Notes on the sheet
- Allows system to be powered off battery, or charge battery using USB while USB powers the circuit
- 4.2V Out
- (near U2) High (>1.4V) for 500mA
- R_Set = (V_Set x K_Set)/I_Out
  V_Set = 2.5V
  K_Set = 425 (100mA < I_Out < 1A)
  R_Set = 2100
  I_Out = 505.9
- (near U2) EP is GND Pad
- R_DPPM = V_DPPM-REG / (I_DPPM x SF)
  SF = 1.15
  I_DPPM = 100uA
  R_DPPM = 36.5k
  V_DPPM = 4.1975V
- R_TMR = t_CHG / K_TMR
  K_TMR = 0.36
  t_CHG = Capacity / I_CHG
  = 2 / 0.5 = 4hrs
  R_TMR = 5184
  If R_TMR = 5100, t_CHG = 3.93hrs

### Library data of the parts
C8 = CMP-2006-04193-2: General Purpose Ceramic Capacitor, 0603, 1uF, 10%, X5R, 15%, 25V; Insulation Resistance: 10GR; Dissipation Factor: 12.5%; Lead Free: Lead Free; Max Operating Temperature: 85°C; Construction: Flat; Series: -; Number of Pins: 2; Dielectric: X5R; RoHS Compliant: Yes; Radiation Hardening: No; Package Quantity: 1; Height: 0.9mm; Capacitance: 1uF; Tolerance: 10%; Termination: SMD/SMT; Voltage Rating: 25V; Case Code (Imperial): 0603; Min Operating Temperature: -55°C; Packaging: Tape and Reel; Width: 0.032inch; Thickness: 0.035inch; REACH SVHC: No SVHC; Voltage Rating (DC): 25V; Case/Package: 0603; Voltage: 25V; Depth: 0.81mm; Mount: Surface Mount; Dielectric Material: Ceramic; Contact Plating: Tin; Length: 1.6mm; Case Code (Metric): 1608
C9-C11 = CMP-2000-04979-3: Multilayer Ceramic Capacitors 10μF ±10% 10V X5R SMD 0603; Capacitance: 10uF; Dielectric Material: Ceramic; Construction: Flat; Height: 0.8mm; Thickness: 0.035inch; Case Code (Metric): 1608; Radiation Hardening: No; Number of Pins: 2; Voltage Rating (DC): 10V; Depth: 0.8mm; Voltage: 10V; RoHS Compliant: Yes; Voltage Rating: 10V; Package Quantity: 1; Resistor Type: Ceramic; Termination: SMD/SMT; Lead Free: Lead Free; REACH SVHC: No SVHC; Tolerance: 10%; Mount: Surface Mount; Series: C; Packaging: Tape and Reel; Width: 0.8mm; Dielectric: X5R; Weight: 7.1E-05oz; Length: 1.6mm; Max Operating Temperature: 85°C; Case Code (Imperial): 0603; Case/Package: 0603; Min Operating Temperature: -55°C
D1-D3 = CMP-22017-000005-2: LED GREEN CLEAR CHIP SMD; Dominant Wavelength: 569nm; Reverse Voltage: 5V; Lens Color: Colorless; Viewing Angle: 130°; Voltage: 2V; Forward Current: 30mA; Power Dissipation: 100mW; Luminous Intensity: 6mcd; Number of LEDs: 1; Forward Voltage: 2.1V; Wavelength: 565nm; Test Current: 10mA; Min Operating Temperature: -55°C; Lens Style: Clear; Mount: Surface Mount; Width: 0.8mm; Packaging: Tape and Reel; Lens Transparency: Clear; Case Code (Metric): 1608; Depth: 0.8mm; Case Code (Imperial): 0603; Case/Package: 0603; Number of Pins: 2; Max Operating Temperature: 85°C; Lead Free: Lead Free; Number of Elements: 1; Length: 1.6mm; Height: 0.8mm; Package Quantity: 1; Power Rating: 100mW; Radiation Hardening: No; Illumination Color: Green; Color: Green
R8 = NTCALUG39A103GA: NTC (Negative Temperature Coefficient) Thermistors 10K/2% 3984K/0.5% AEC-Q200 70mm; Beta Parameter: 3984 K; Tolerance: 2%; Voltage Rating: 1kV; RoHS Compliant: RoHS; Case/Package: Wire Lead; Max Operating Temperature: 125°C; Mounting Technology: Ring Lug; Min Operating Temperature: -40°C; Pins: 2
R_DPPM1 = RQ73C1J36K5BTD: Thin Film Resistors - SMD RN 0603 36K5 0.1% 10PPM; Value: 36.5k
R_Set1 = CRCW06032K10FKEAC: Thick Film Resistors - SMD 1/10Watt 2.1Kohms 1%; Value: 2.1K
R_TMR1 = ERA-3AED512V: Thin Film Resistors - SMD 0603 5100ohms 25ppm 0.5% AEC-Q200; Value: 5.1k
U2 = BQ24030RHLR: Battery Management Charger w/Dynamic Power-Path Mngmnt; Manufacturer_Name: Texas Instruments; Datasheet Link: http://www.ti.com/lit/gpn/bq24030; Manufacturer_Part_Number: BQ24030RHLR; Mouser Part Number: 595-BQ24030RHLR; Mouser Price/Stock: https://www.mouser.co.uk/ProductDetail/Texas-Instruments/BQ24030RHLR/?qs=%252BvKcWiXw%252BzShgRCa3gfG7Q%3D%3D; Arrow Part Number: BQ24030RHLR; Arrow Price/Stock: https://www.arrow.com/en/products/bq24030rhlr/texas-instruments

## Sheet SD Card.SchDoc
size A4; SheetNumber: 3; SheetTotal: 8
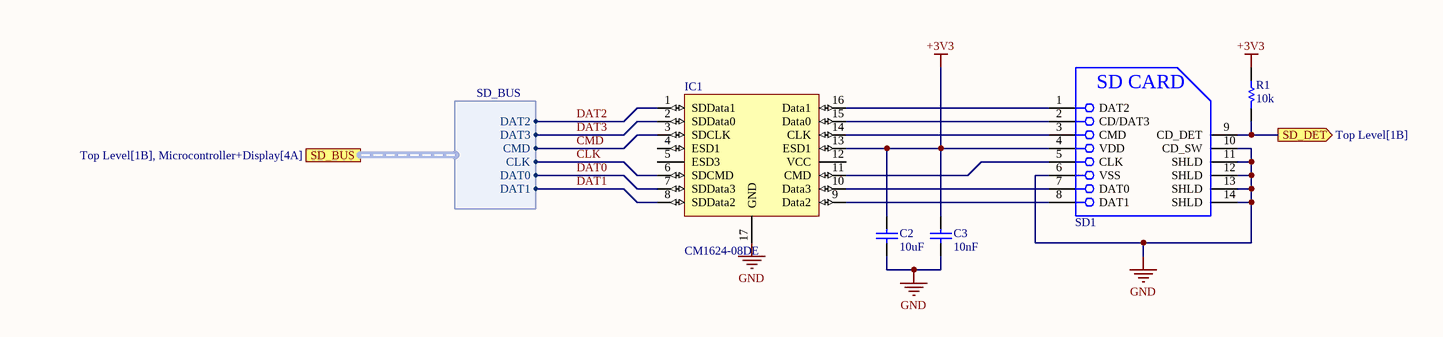
[diagram p6: SD Card.SchDoc]

### Parts
C2  value 10uF  [CAPC2012X14N]  (hidden comment: C0805C106K8PACTU)
C3  value 10nF  [CAPC1608X10N]  (hidden comment: C0603C103J5RACTU)
IC1  CM1624-08DE  [SON40P140X55_HS-17N]
R1  value 10k  [0603]  (hidden comment: CRCW060310K0FKEA)
SD1  5027740891  [5027740891-Footprint-1]  (value not drawn)

### Ports
SD_BUS (harness SD_BUS, see Top Level[1B], Microcontroller+Display[4A]), SD_DET (out, see Top Level[1B])

### Harnesses
SD_BUS: DAT1, DAT0, CLK, CMD, DAT3, DAT2

### Nets
+3V3: C2.2 C3.2 IC1.13(ESD1) R1.1 SD1.4(VDD)
GND: C2.1 C3.1 IC1.17(GND) SD1.6(VSS) SD1.10(CD_SW) SD1.11(SHLD) SD1.12(SHLD) SD1.13(SHLD) SD1.14(SHLD)
CLK: IC1.6(SDCMD) ; port SD_BUS.CLK
CMD: IC1.3(SDCLK) ; port SD_BUS.CMD
DAT0: IC1.7(SDData3) ; port SD_BUS.DAT0
DAT1: IC1.8(SDData2) ; port SD_BUS.DAT1
DAT2: IC1.1(SDData1) ; port SD_BUS.DAT2
DAT3: IC1.2(SDData0) ; port SD_BUS.DAT3
NetIC1_9: IC1.9(Data2) SD1.8(DAT1)
NetIC1_10: IC1.10(Data3) SD1.7(DAT0)
NetIC1_11: IC1.11(CMD) SD1.5(CLK)
NetIC1_14: IC1.14(CLK) SD1.3(CMD)
NetIC1_15: IC1.15(Data0) SD1.2(CD/DAT3)
NetIC1_16: IC1.16(Data1) SD1.1(DAT2)
NetR1_2: R1.2 SD1.9(CD_DET) ; port SD_DET

Not connected (* = marked no-connect by the designer): IC1 4(ESD1) 5(ESD3) 12(VCC)

### Notes on the sheet
- (in symbol 5027740891) SD CARD

### Library data of the parts
C2 = C0805C106K8PACTU: CAP CER 10UF 10V X5R 0805; Dielectric Material: Ceramic; Dissipation Factor: 10%; Width: 1.2mm; Number of Pins: 2; Voltage: 10V; Packaging: Tape and Reel; Dielectric: X5R; Mount: Surface Mount; Case/Package: 0805; Thickness: 0.055inch; Package Quantity: 1; Voltage Rating (DC): 10V; Case Code (Imperial): 0805; Tolerance: 10%; Max Operating Temperature: 85°C; Radiation Hardening: No; Termination: SMD/SMT; Height: 1.25mm; Voltage Rating: 10V; Capacitance: 10uF; Length: 2mm; Min Operating Temperature: -55°C; Depth: 1.25mm; REACH SVHC: No SVHC; Case Code (Metric): 2012; Contact Plating: Tin,Matte; JLC_PN: C15850
C3 = C0603C103J5RACTU: Cap Ceramic 0.01uF 50V X7R 5% SMD 0603 125C Paper T/R; Dielectric: X7R; Case/Package: 0603; Height: 0.8mm; Capacitance: 10nF; Depth: 0.8mm; Length: 1.6mm; Min Operating Temperature: -55°C; Radiation Hardening: No; Packaging: Tape and Reel; Max Operating Temperature: 125°C; Mount: Surface Mount; Tolerance: 5%; JLC_PN: C57112
IC1 = CM1624-08DE: EMI Filter Flat Style SMD T/R; Capacitance: 20pF; Operating Supply Voltage: 5V; ESD Protection: Yes; Clamping Voltage: 9V; DC Resistance (DCR): 40R; Number of Channels: 6; Number of Lines: 8; Direction: Bidirectional; Depth: 1.45mm; Length: 3.4mm; Height: 0.022inch; Halogen Free: Halogen Free; REACH SVHC: No SVHC; Contact Plating: Tin,Matte; Number of Pins: 16; Termination: Flat; Package Quantity: 1; Min Operating Temperature: -40°C; Lead Free: Lead Free; Packaging: Tape and Reel; Case/Package: DFN; Max Operating Temperature: 85°C; Width: 1.35mm
R1 = CRCW060310K0FKEA: RES SMD 10K OHM 0.5% 1/10W 0603
SD1 = 5027740891: MOLEX   502774-0891.   MEMORY CARD CONNECTOR, MICROSD, 8POS; Current Rating: 500mA; Number of Contacts: 8; Pitch: 1.1mm; Gender: Male; Max Voltage Rating (DC): 1.01kV; Voltage Rating (AC): 10V; Max Operating Temperature: 85°C; Radiation Hardening: No; Depth: 16mm; Number of Rows: 1; Mount: Surface Mount,Reverse; Height: 1.8mm; Min Operating Temperature: -25°C; Length: 14.6mm; Package Quantity: 1; Contact Material: Copper Alloy,Copper; Housing Material: Polymer; Width: 1.8mm; Contact Plating: Gold; Orientation: Right Angle; Number of Circuits: 8; REACH SVHC: Unknown; Packaging: Tape and Reel; Halogen Free: Low Halogen; Termination: Solder; Connector Type: Connector

## Nets that join several sheets
+3V3: IO (J1.17 J1.18 J5.1 SWD1.1), Charging System (C11.2 U2.1 U2.7), SD Card (5 pins)
+5: Voltage Regulation (C4.1 C5.1 R2.1 U1.9), IO (J3.1), Transceiver (C1.2 U3.19)
BAT+: IO (J2.1), Battery Protection (R14.1), Charging System (6 pins)
BAT_RAW-: IO (J2.2), Battery Protection (5 pins)
GND: Voltage Regulation (8 pins), IO (25 pins), Transceiver (18 pins), Battery Protection (Q2.1 Q2.2 Q2.3 R15.2), Charging System (10 pins), SD Card (9 pins)
USB: IO (5 pins), Charging System (C9.2 U2.20)
NetC6_1: Voltage Regulation (6 pins), Charging System (C10.2 U2.15 U2.16 U2.17)